# EAGLE schematic commadorable64-v1 (EAGLE 6.5.0)
CNAME: An adorable Commodore 64; CREVISION: 1; DESIGNER: Johan Kanflo
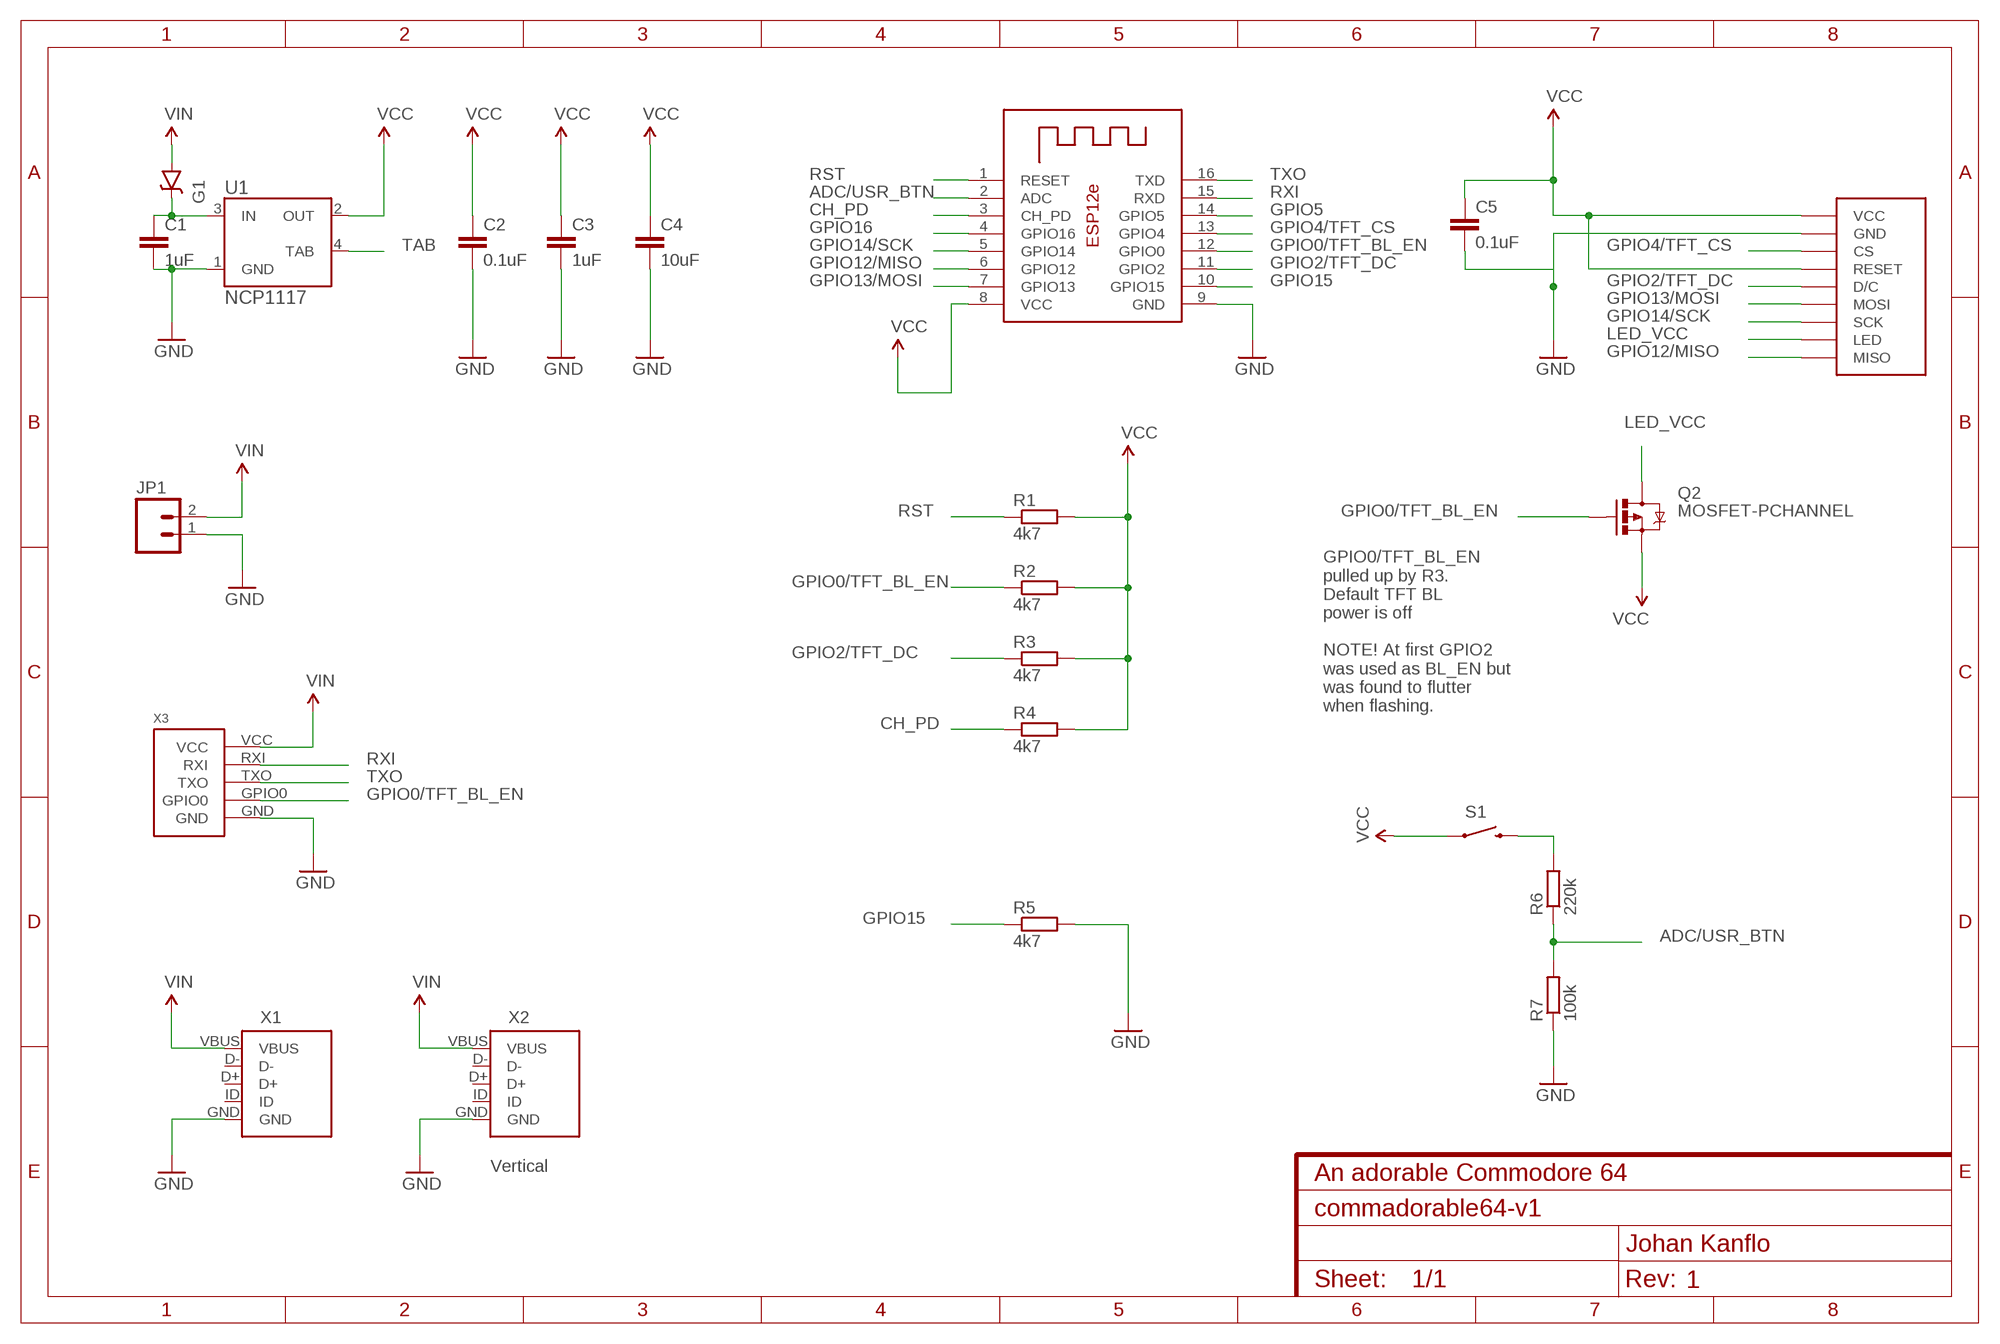
[diagram p0: schematic, sheet 1]

## Parts
C1  1uF  CAP0603-CAP  [0603-CAP]
C2  0.1uF  CAP0603-CAP  [0603-CAP]
C3  1uF  CAP0603-CAP  [0603-CAP]
C4  10uF  CAP0603-CAP  [0603-CAP]
C5  0.1uF  CAP0603-CAP  [0603-CAP]
G1  DIODE-SCHOTTKYSOD-123FL  [SOD-123FL]
J2  SPI_TFT_DISPLAY  [SPI_DISPLAY]
JP1  M02PTH  [1X02]
Q2  MOSFET-PCHANNEL  [SOT23-3]
R1  4k7  R-EU_R0603  [R0603]
R2  4k7  R-EU_R0603  [R0603]
R3  4k7  R-EU_R0603  [R0603]
R4  4k7  R-EU_R0603  [R0603]
R5  4k7  R-EU_R0603  [R0603]
R6  220k  R-EU_R0603  [R0603]
R7  100k  R-EU_R0603  [R0603]
S1  SWITCH-MOMENTARY-2SMD-1101NE  [TACTILE-SWITCH-1101NE]
U1  NCP1117  [SOT223]
U2  ESP-12E  [ESP-12E]
X1  MICRO_USB_TH  [MICRO_USB_TH]
X2  MICRO_USB_TH_VERTICAL  [MICRO_USB_TH_VERTICAL]
X3  ESPROGESPROG-DEVICE  [ESPROG]

## Nets
ADC/USR_BTN: R6.1 R7.2 U2.2(ADC)
CH_PD: R4.1 U2.3(CH_PD)
GND: C1.2 C2.2 C3.2 C4.2 C5.2 J2.GND JP1.1 R5.2 R7.1 U1.1(GND) U2.9(GND) X1.GND X2.GND X3.GND
GPIO0/TFT_BL_EN: Q2.1(G) R2.1 U2.12(GPIO0) X3.GPIO0
GPIO2/TFT_DC: J2.D/C R3.1 U2.11(GPIO2)
GPIO4/TFT_CS: J2.CS U2.13(GPIO4)
GPIO5: U2.14(GPIO5)
GPIO12/MISO: J2.MISO U2.6(GPIO12)
GPIO13/MOSI: J2.MOSI U2.7(GPIO13)
GPIO14/SCK: J2.SCK U2.5(GPIO14)
GPIO15: R5.1 U2.10(GPIO15)
GPIO16: U2.4(GPIO16)
LED_VCC: J2.LED Q2.3(D)
N$1: C1.1 G1.C U1.3(IN)
N$4: R6.2 S1.2
RST: R1.1 U2.1(RESET)
RXI: U2.15(RXD) X3.RXI
TAB: U1.4(TAB)
TXO: U2.16(TXD) X3.TXO
VCC: C2.1 C3.1 C4.1 C5.1 J2.RESET J2.VCC Q2.2(S) R1.2 R2.2 R3.2 R4.2 S1.1 U1.2(OUT) U2.8(VCC)
VIN: G1.A JP1.2 X1.VBUS X2.VBUS X3.VCC
Unconnected: X1.D+ X1.D- X1.ID X2.D+ X2.D- X2.ID

## Notes on the sheet
- GPIO0/TFT_BL_EN
  pulled up by R3.
  Default TFT BL
  power is off
  
  NOTE! At first GPIO2
  was used as BL_EN but
  was found to flutter
  when flashing.
- Vertical

## Library data of the parts
C1-C5 = SparkFun-Capacitors:CAP: Capacitor Standard 0603 ceramic capacitor, and 0.1" leaded capacitor.
G1 = kanflo:DIODE-SCHOTTKY
J2 = kanflo:SPI_TFT_DISPLAY: SPI TFT Display Connector for the cheap 2.4" Serial SPI TFT displays found on eBay.
JP1 = SparkFun-Connectors:M02: Standard 2-pin 0.1" header. Use with - straight break away headers ( PRT-00116) - right angle break away headers (PRT-00553) - swiss pins (PRT-00743) - machine pins (PRT-00117) - female headers (PRT-00115) Molex polarized connector foot print use with: PRT-08233 with associated crimp pins and housings. 2.54_SCREWTERM for use with PRT-10571. 3.5mm Screw Terminal footprints for PRT-08084 5mm Screw Terminal footprints for use with PRT-08432
Q2 = SparkFun-DiscreteSemi:MOSFET-PCHANNEL: Generic PMOSFET IRLML2244 - TRANS-11153 (SOT-23 -20V -4.3A) (1.Gate 2.Source 3.Drain) FQP27P06 - COM-10349 <http://www.sparkfun.com/products/10349> (TO-220 -60V -27A) (1.Gate 2.Source 3.Drain); PROD_ID: TRANS-08285
R1-R7 = resistor:R-EU_: RESISTOR, European symbol
S1 = SparkFun-Electromechanical:SWITCH-MOMENTARY-2: Various NO switches- pushbuttons, reed, etc; PROD_ID: SWCH-00815
U1 = ELL-i-PowerIC:NCP1117
U2 = kanflo:ESP-12E: ESP12e module This is a copy of AdaFruit's device with correct pin order for GPIO4 and GPIO5.
X1 = kanflo:MICRO_USB_TH: Micro USB through hole connector A low cost micro USB connector from eBay, found here <http://www.ebay.com/itm/171309997171>.
X2 = kanflo:MICRO_USB_TH_VERTICAL: Vertical micro USB through hole connector A low cost vertical micro USB connector from eBay, found here <http://www.ebay.com/itm/181392933768>.
X3 = kanflo:ESPROG